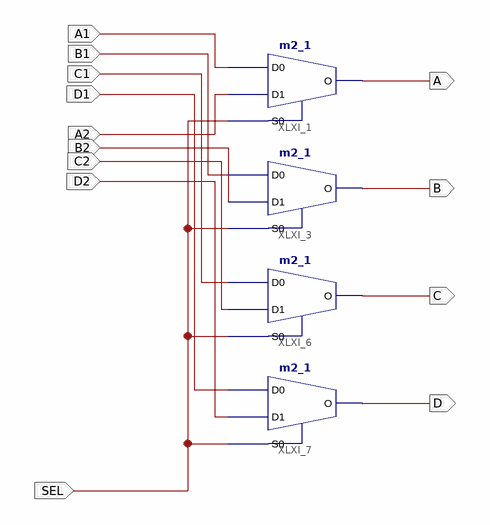
[diagram p0: schematic sheet 1]
// Xilinx ISE schematic mux84.sch (spartan6) as structural Verilog: 4 symbols, 13 ports
module mux84 (
  input  SEL,
  input  A1,
  input  B1,
  input  C1,
  input  D1,
  input  A2,
  input  B2,
  input  C2,
  input  D2,
  output A,
  output B,
  output C,
  output D
);

  m2_1 XLXI_1 (.D0(A1), .D1(A2), .S0(SEL), .O(A));
  m2_1 XLXI_3 (.D0(B1), .D1(B2), .S0(SEL), .O(B));
  m2_1 XLXI_6 (.D0(C1), .D1(C2), .S0(SEL), .O(C));
  m2_1 XLXI_7 (.D0(D1), .D1(D2), .S0(SEL), .O(D));
endmodule
